# Altium schematic sheet Depth.SchDoc
size A
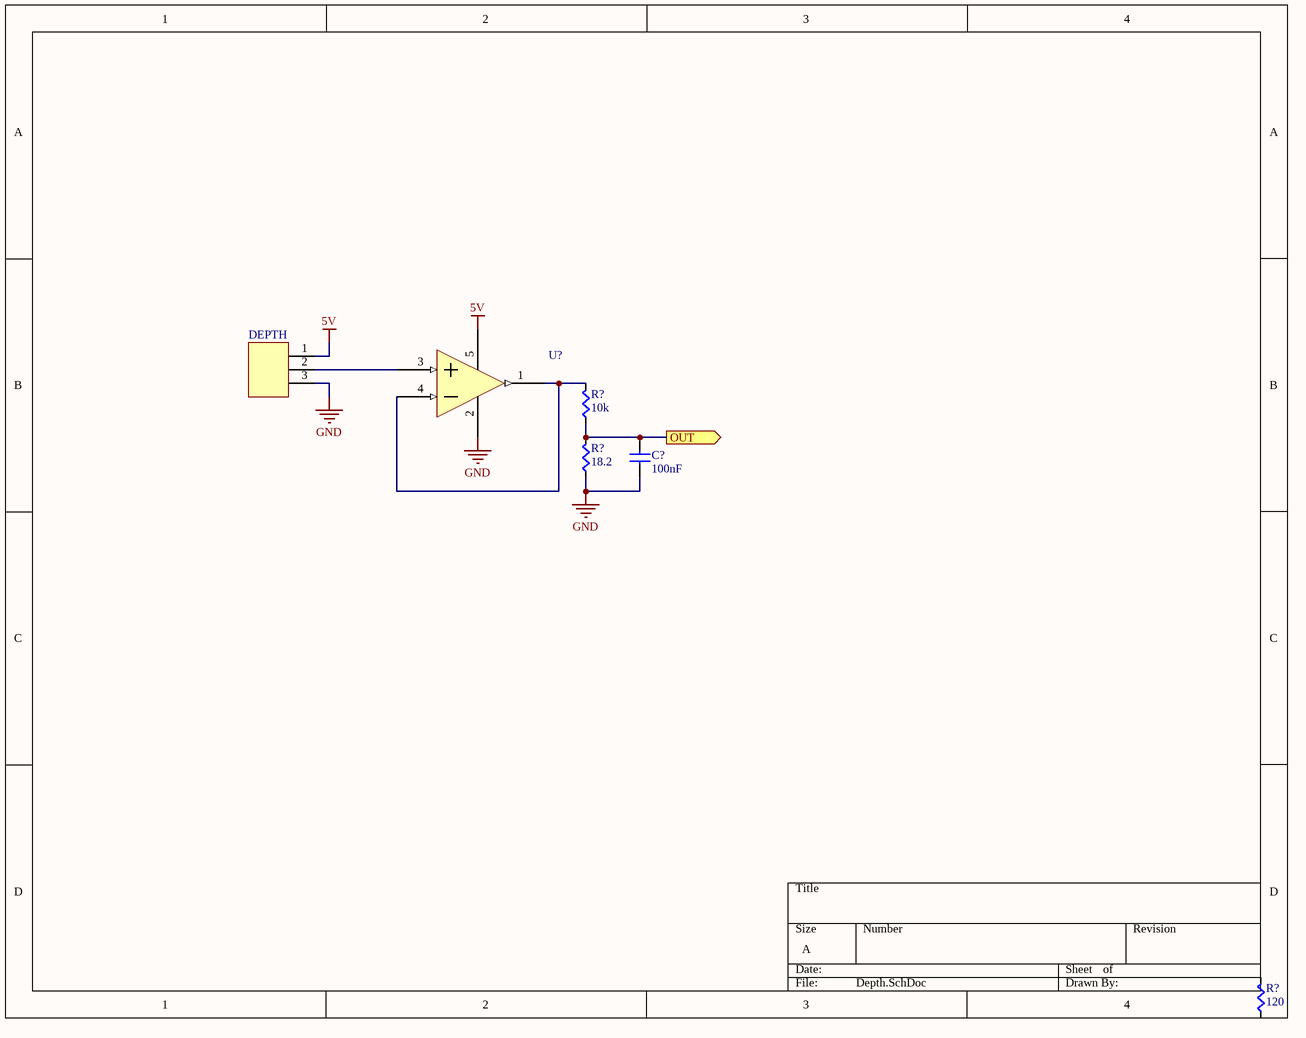
[diagram p0: Depth.SchDoc]

## Parts
(Parts that share a designator on the sheet are numbered #1, #2 ... from top to bottom, then left to right.)
C?  value 100nF  [CAPC0603]  (hidden comment: Cap)
DEPTH  3pos RA sherlock connector  [MOLEX-HDR-1X3-SHERLOCK-RA]  (value not drawn)
R?#1  value 10k  [RES0603]  (hidden comment: Res)
R?#2  value 18.2  [RES0603]  (hidden comment: Res)
R?#3  value 120  [RES0603]  (hidden comment: Res)
U?  MCP6L01  [MCP6L01R]  (value not drawn)

## Ports
OUT (out)

## Nets
5V: DEPTH.1 U?.5(VDD)
GND: C?.2(B) DEPTH.3 R?#2.2(B) U?.2(VSS)
OUT: C?.1(A) R?#1.2(B) R?#2.1(A) ; port OUT
NetDEPTH_2: DEPTH.2 U?.3(VIN+)
NetR?#1_1: R?#1.1(A) U?.1(VOUT) U?.4(VIN-)

Not connected (* = marked no-connect by the designer): R?#3 1(A) 2(B)

## Library data of the parts
DEPTH = MOLEX-HDR-1x3-SHERLOCK_RA: Header, Molex, 2mm Pitch Sherlock Header, Single Row, Right Angle 3 Circuits, Length 3.3mm; Manufacturer Part Number: 35363-0360; Manufacturer: Molex Connector Corporation; Supplier Part Number: WM18932-ND; Supplier: Digi-Key
U? = MCP6L01: Op Amp Rail-to-Rail 1Mhz; Supplier 1: Digi-Key; Supplier Part Number 1: MCP6L01T-E/OTCT-ND
C? = Cap: Supplier 1: Digi-Key; Supplier Part Number 1: 1276-1000-1-ND
R?#1-R?#3 = Res: Supplier 1: Digi-Key
  R?#1: Supplier Part Number 1: RR08P10.0KDCT-ND
  R?#2: Supplier Part Number 1: P18.2BMCT-ND
  R?#3: Supplier Part Number 1: RMCF0603JT10K0CT-ND